# EAGLE schematic megger (EAGLE 9.5.1)
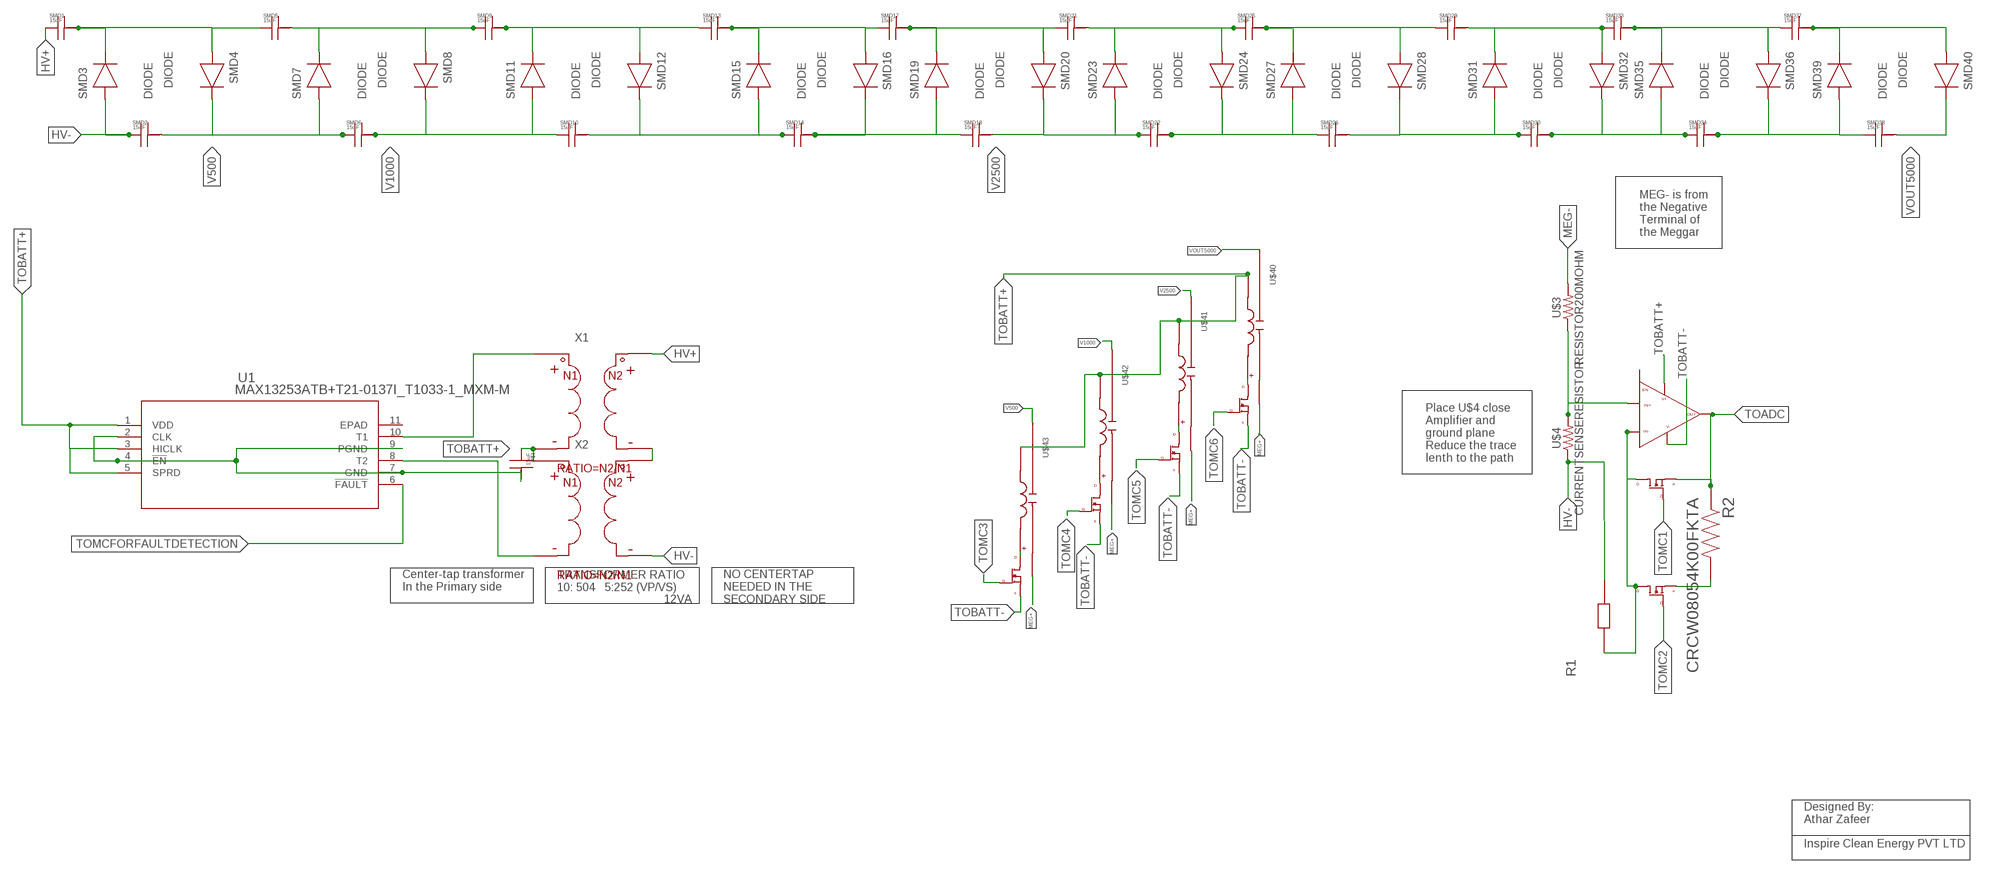
[diagram p0: schematic, sheet 1]

## Parts
R1  ERJ-2GEJ102X  [RESC1005X40N]
R2  CRCW08054K00FKTA  [RESC2012X50N]
SMD1  15uF  CAPACITORSMDC5750SMD  [C5750]
SMD2  15uF  CAPACITORSMDC5750SMD  [C5750]
SMD3  DIODE  [SMA]
SMD4  DIODE  [SMA]
SMD5  15uF  CAPACITORSMDC5750SMD  [C5750]
SMD6  15uF  CAPACITORSMDC5750SMD  [C5750]
SMD7  DIODE  [SMA]
SMD8  DIODE  [SMA]
SMD9  15uF  CAPACITORSMDC5750SMD  [C5750]
SMD10  15uF  CAPACITORSMDC5750SMD  [C5750]
SMD11  DIODE  [SMA]
SMD12  DIODE  [SMA]
SMD13  15uF  CAPACITORSMDC5750SMD  [C5750]
SMD14  15uF  CAPACITORSMDC5750SMD  [C5750]
SMD15  DIODE  [SMA]
SMD16  DIODE  [SMA]
SMD17  15uF  CAPACITORSMDC5750SMD  [C5750]
SMD18  15uF  CAPACITORSMDC5750SMD  [C5750]
SMD19  DIODE  [SMA]
SMD20  DIODE  [SMA]
SMD21  15uF  CAPACITORSMDC5750SMD  [C5750]
SMD22  15uF  CAPACITORSMDC5750SMD  [C5750]
SMD23  DIODE  [SMA]
SMD24  DIODE  [SMA]
SMD25  15uF  CAPACITORSMDC5750SMD  [C5750]
SMD26  15uF  CAPACITORSMDC5750SMD  [C5750]
SMD27  DIODE  [SMA]
SMD28  DIODE  [SMA]
SMD29  15uF  CAPACITORSMDC5750SMD  [C5750]
SMD30  15uF  CAPACITORSMDC5750SMD  [C5750]
SMD31  DIODE  [SMA]
SMD32  DIODE  [SMA]
SMD33  15uF  CAPACITORSMDC5750SMD  [C5750]
SMD34  15uF  CAPACITORSMDC5750SMD  [C5750]
SMD35  DIODE  [SMA]
SMD36  DIODE  [SMA]
SMD37  15uF  CAPACITORSMDC5750SMD  [C5750]
SMD38  15uF  CAPACITORSMDC5750SMD  [C5750]
SMD39  DIODE  [SMA]
SMD40  DIODE  [SMA]
U1  MAX13253ATB+T21-0137I_T1033-1_MXM-M  [21-0137I_T1033-1_MXM-M]
U$1  15uF  CAPACTORFORTRANSFORMER  [C1210C156K8PACTU]
U$2  OPA300-ND  [SOT23-6]
U$3  RESISTOR200MOHM  RESISTOR20OHM  [RADIAL]
U$4  CURRENTSENSERESISTOR  [SL2TTED1002F]
U$5  SI2302A  [SOT-23]
U$6  SI2302A  [SOT-23]
U$7  SI2302A  [SOT-23]
U$8  SI2302A  [SOT-23]
U$9  SI2302A  [SOT-23]
U$10  SI2302A  [SOT-23]
U$40  REEDRELAYSPDT  [3351-1275-126]
U$41  REEDRELAYSPDT  [3351-1275-126]
U$42  REEDRELAYSPDT  [3351-1275-126]
U$43  REEDRELAYSPDT  [3351-1275-126]
X1  TRANSFORMER  (no package)
X2  TRANSFORMER  (no package)

## Nets
HV+: SMD1.P$1 X1.P$3
HV-: R1.2 SMD2.P$1 SMD3.P$1(A) U$4.P$1 X2.P$4
MEG+: U$40.1 U$41.1 U$42.1 U$43.1
MEG-: U$3.P$2
N$1: SMD1.P$2 SMD3.P$2(C) SMD4.P$1(A) SMD5.P$1
N$2: R1.1 U$2.P$4(IN-) U$5.D U$6.D
N$3: U$2.P$3(IN+) U$3.P$1 U$4.P$2
N$4: SMD5.P$2 SMD7.P$2(C) SMD8.P$1(A) SMD9.P$1
N$5: R2.2 U$6.S
N$6: SMD9.P$2 SMD11.P$2(C) SMD12.P$1(A) SMD13.P$1
N$7: SMD10.P$2 SMD12.P$2(C) SMD14.P$1 SMD15.P$1(A)
N$8: SMD13.P$2 SMD15.P$2(C) SMD16.P$1(A) SMD17.P$1
N$9: SMD14.P$2 SMD16.P$2(C) SMD18.P$1 SMD19.P$1(A)
N$10: SMD17.P$2 SMD19.P$2(C) SMD20.P$1(A) SMD21.P$1
N$11: U$7.D U$43.2
N$12: U$8.D U$42.2
N$13: SMD21.P$2 SMD23.P$2(C) SMD24.P$1(A) SMD25.P$1
N$14: SMD22.P$2 SMD24.P$2(C) SMD26.P$1 SMD27.P$1(A)
N$15: SMD25.P$2 SMD27.P$2(C) SMD28.P$1(A) SMD29.P$1
N$16: U$9.D U$41.2
N$17: U1.8(T2) X2.P$2
N$18: U$10.D U$40.2
N$19: SMD29.P$2 SMD31.P$2(C) SMD32.P$1(A) SMD33.P$1
N$22: SMD26.P$2 SMD28.P$2(C) SMD30.P$1 SMD31.P$1(A)
N$23: SMD37.P$2 SMD39.P$2(C) SMD40.P$1(A)
N$24: SMD30.P$2 SMD32.P$2(C) SMD34.P$1 SMD35.P$1(A)
N$25: SMD33.P$2 SMD35.P$2(C) SMD36.P$1(A) SMD37.P$1
N$26: SMD34.P$2 SMD36.P$2(C) SMD38.P$1 SMD39.P$1(A)
N$28: U1.2(CLK) U1.4(!EN) U1.7(GND) U1.9(PGND) U$1.P$2
N$29: U1.10(T1) X1.P$1
N$31: X1.P$4 X2.P$3
TOADC: R2.1 U$2.P$1(OUT) U$5.S
TOBATT+: U1.1(VDD) U1.3(HICLK) U1.5(SPRD) U$1.P$1 U$2.P$6(V+) U$40.3 U$41.3 U$42.3 U$43.3 X1.P$2 X2.P$1
TOBATT-: U$2.P$2(V-) U$7.S U$8.S U$9.S U$10.S
TOMC1: U$5.G
TOMC2: U$6.G
TOMC3: U$7.G
TOMC4: U$8.G
TOMC5: U$9.G
TOMC6: U$10.G
TOMCFORFAULTDETECTION: U1.6(!FAULT)
V500: SMD2.P$2 SMD4.P$2(C) SMD6.P$1 SMD7.P$1(A) U$43.4
V1000: SMD6.P$2 SMD8.P$2(C) SMD10.P$1 SMD11.P$1(A) U$42.4
V2500: SMD18.P$2 SMD20.P$2(C) SMD22.P$1 SMD23.P$1(A) U$41.4
VOUT5000: SMD38.P$2 SMD40.P$2(C) U$40.4
Unconnected: U1.11(EPAD) U$2.P$5(EN)

## Notes on the sheet
- MEG- is from
  the Negative
  Terminal of
  the Meggar
- Place U$4 close 
  Amplifier and 
  ground plane
  Reduce the trace 
  lenth to the path
- TRANSFORMER RATIO
  10: 504
- 5:252 (VP/VS)
- Center-tap transformer
  In the Primary side
- 12VA
- NO CENTERTAP 
  NEEDED IN THE 
  SECONDARY SIDE
- Designed By:
  Athar Zafeer
- Inspire Clean Energy PVT LTD

## Library data of the parts
R1 = Ampparts:ERJ-2GEJ102X; DESCRIPTION: 1 kOhms ±5% 0.1W, 1/10W Chip Resistor 0402 (1005 Metric) Automotive AEC-Q200 Thick Film; DIGI-KEY_PART_NUMBER: P1.0KJCT-ND; MF: Panasonic Electronic; MP: ERJ-2GEJ102X; PACKAGE: 1005 Panasonic Electronic Components
R2 = Ampparts:CRCW08054K00FKTA: THICK FILM CHIP RESISTORS; DESCRIPTION: 4 kOhms ±1% 0.125W, 1/8W Chip Resistor 0805 (2012 Metric) Automotive AEC-Q200 Thick Film; DIGI-KEY_PART_NUMBER: 541-CRCW08054K00FKTACT-ND; MF: Vishay Dale; MP: CRCW08054K00FKTA; PACKAGE: 2012 Vishay
SMD1 SMD2 SMD5 SMD6 SMD9 SMD10 SMD13 SMD14 SMD17 SMD18 SMD21 SMD22 SMD25 SMD26 SMD29 SMD30 SMD33 SMD34 SMD37 SMD38 = CAP_Diode_Megger:CAPACITORSMDC5750: Middle voltage C series, commercial grade of TDK's multilayer ceramic chip capacitor, is a product which has the high withstanding voltage characteristics. The lineup is voltage rating of 100V to 630V with capacitance range up to 22µF. Product link (digikey) <https://www.digikey.in/product-detail/en/C5750X6S2W225K250KA/445-7781-1-ND/2733853/?itemSeq=327727969> 2.2µF ±10% 450V Ceramic Capacitor X6S 2220 (5750 Metric) Datasheet <https://product.tdk.com/info/en/catalog/datasheets/mlcc_commercial_midvoltage_en.pdf> Model by Athar Zafeer; SPICEPREFIX: C
SMD3 SMD4 SMD7 SMD8 SMD11 SMD12 SMD15 SMD16 SMD19 SMD20 SMD23 SMD24 SMD27 SMD28 SMD31 SMD32 SMD35 SMD36 SMD39 SMD40 = CAP_Diode_Megger:DIODE: Features  Glass Passivated Die Construction  Ultra-Fast Recovery Time for High Efficiency  Surge Overload Rating to 30A Peak  High Current Capability  Ideally Suited for Automated Assembly  Lead-Free Finish; RoHS Compliant (Note 1)  Halogen and Antimony Free. “Green” Device (Note 2) Datasheet <https://www.diodes.com/assets/Datasheets/ds16008.pdf> Modelled by Athar Zafeer; SPICEPREFIX: D
U1 = MAX13253:MAX13253ATB+T; BUILT_BY: EMA_UL_Team; MANUFACTURER_PART_NUMBER: MAX13253ATB+T; SOURCELIBRARY: Maxim_2015-01-06; SPICEPREFIX: X; VENDOR: Maxim Integrated Products
U$1 = CAP_Diode_Megger:CAPACTORFORTRANSFORMER: KEMET’s X5R dielectric features an 85°C maximum operating temperature and is considered “semi-stable.” The Electronics Components, Assemblies & Materials Association (EIA) characterizes X5R dielectric as a Class II material. Components of this classification are fixed, ceramic dielectric capacitors suited for bypass and decoupling applications or for frequency discriminating circuits where Q and stability of capacitance characteristics are not critical. X5R exhibits a predictable change in capacitance with respect to time and voltage and boasts a minimal change in capacitance with reference to ambient temperature. Capacitance change is limited to ±15% from −55°C to +85°C Modelled by Athar Zafeer
U$2 = Ampparts:OPA300-ND: The OPA300 and OPA301 series high-speed, voltage-feedback, CMOS operational amplifiers are designed for 16-bit resolution systems. The OPA300/OPA301 series are unity-gain stable and feature excellent settling and harmonic distortion specifications. Low power applications benefit from low quiescent current. The OPA300 and OPA2300 feature a digital shutdown (Enable) function to provide additional power savings during idle periods. Optimized for single-supply operation, the OPA300/OPA301 series offer superior output swing and excellent common-mode range. The OPA300 and OPA301 series op amps have 150MHz of unity-gain bandwidth, low 3nV/√Hz voltage noise, and 0.1% settling within 30ns. Single-supply operation from 2.7V (±1.35V) to 5.5V (±2.75V) and an available shutdown function that reduces supply current to 5µA are useful for portable low-power applications. The OPA300 and OPA301 are available in SO-8 and SOT-23 packages. The OPA2300 is available in MSOP-10, and the OPA2301 is available in SO-8 and MSOP-8. All versions are specified over the industrial temperature range of −40°C to +125°C.
U$3 = CAP_Diode_Megger:RESISTOR20OHM: Ohmite’s Slim-Mox provides stable performance for a wide range of resistance values, with voltage ratings up to 25K. Low temperature coefficients are available for high stability circuit applications. The space-saving planar package offers and alternative to traditional high voltage resistors. Datasheet <https://www.mouser.in/datasheet/2/303/res_slimmox-1265542.pdf> Modelled by Athar Zafeer; SPICEPREFIX: R
U$4 = CAP_Diode_Megger:CURRENTSENSERESISTOR: Current sense Resistor PCB track design around current sense resistors is generally more critical to performance than for normal resistors. The main difference is that four rather than two tracks must be provided to form a Kelvin connection, even where the component itself has only two terminals. The aim is to minimize the conductive path shared between the current path and the sensing loop, which would increase both the tolerance and the TCR of the mounted part. You can do this by connecting the voltage sense tracks to the inner edges of the solder pads (figure 3.) You can also take this a step further and split the voltage sense pads from the current path pads, so that the solder joints are also removed from the shared path By this method it is possible to approach the accuracy obtained from a true four terminal resistor. Modelled by Athar Zafeer
U$5-U$10 = Ampparts:SI2302A
U$40-U$42 = CAP_Diode_Megger:REEDRELAYSPDT: reed relays 7.5KV SPDT INDUSTRY STANDARD PACKAGES • UP TO 10,000 VDC SWITCHING VOLTAGE • UP TO 14,000 VDC DIELECTRIC STRENGTH • UP TO 200 WATTS / 5 AMP CARRY CURRENT • MULTI-POLE, FORM A AND FORM B CONTACTS • CUSTOM DESIGNS WELCOME; SPICEPREFIX: E
U$43 = CAP_Diode_Megger:REEDRELAYSPDT: reed relays 7.5KV SPDT INDUSTRY STANDARD PACKAGES • UP TO 10,000 VDC SWITCHING VOLTAGE • UP TO 14,000 VDC DIELECTRIC STRENGTH • UP TO 200 WATTS / 5 AMP CARRY CURRENT • MULTI-POLE, FORM A AND FORM B CONTACTS • CUSTOM DESIGNS WELCOME; SPICEPREFIX: S
X1 X2 = ngspice-simulation:TRANSFORMER: Coupled inductors The RATIO is defined in the schematic by using the text command and adding a line that says: .PARAM RATIO=x Where x is the turns ratio of the transformer